# EasyEDA Pro project U2HTS_F070F6.epro

# Schematic Sch
Board Name: U2HTS_F070F6; Create Date: 2025-08-04; Page Name: P1; Project Name: USB电容触摸屏驱动板; Schematic Name: Sch; Update Date: 2025-08-04; Company: 嘉立创EDA; Page Size: A4; Version: V1.0
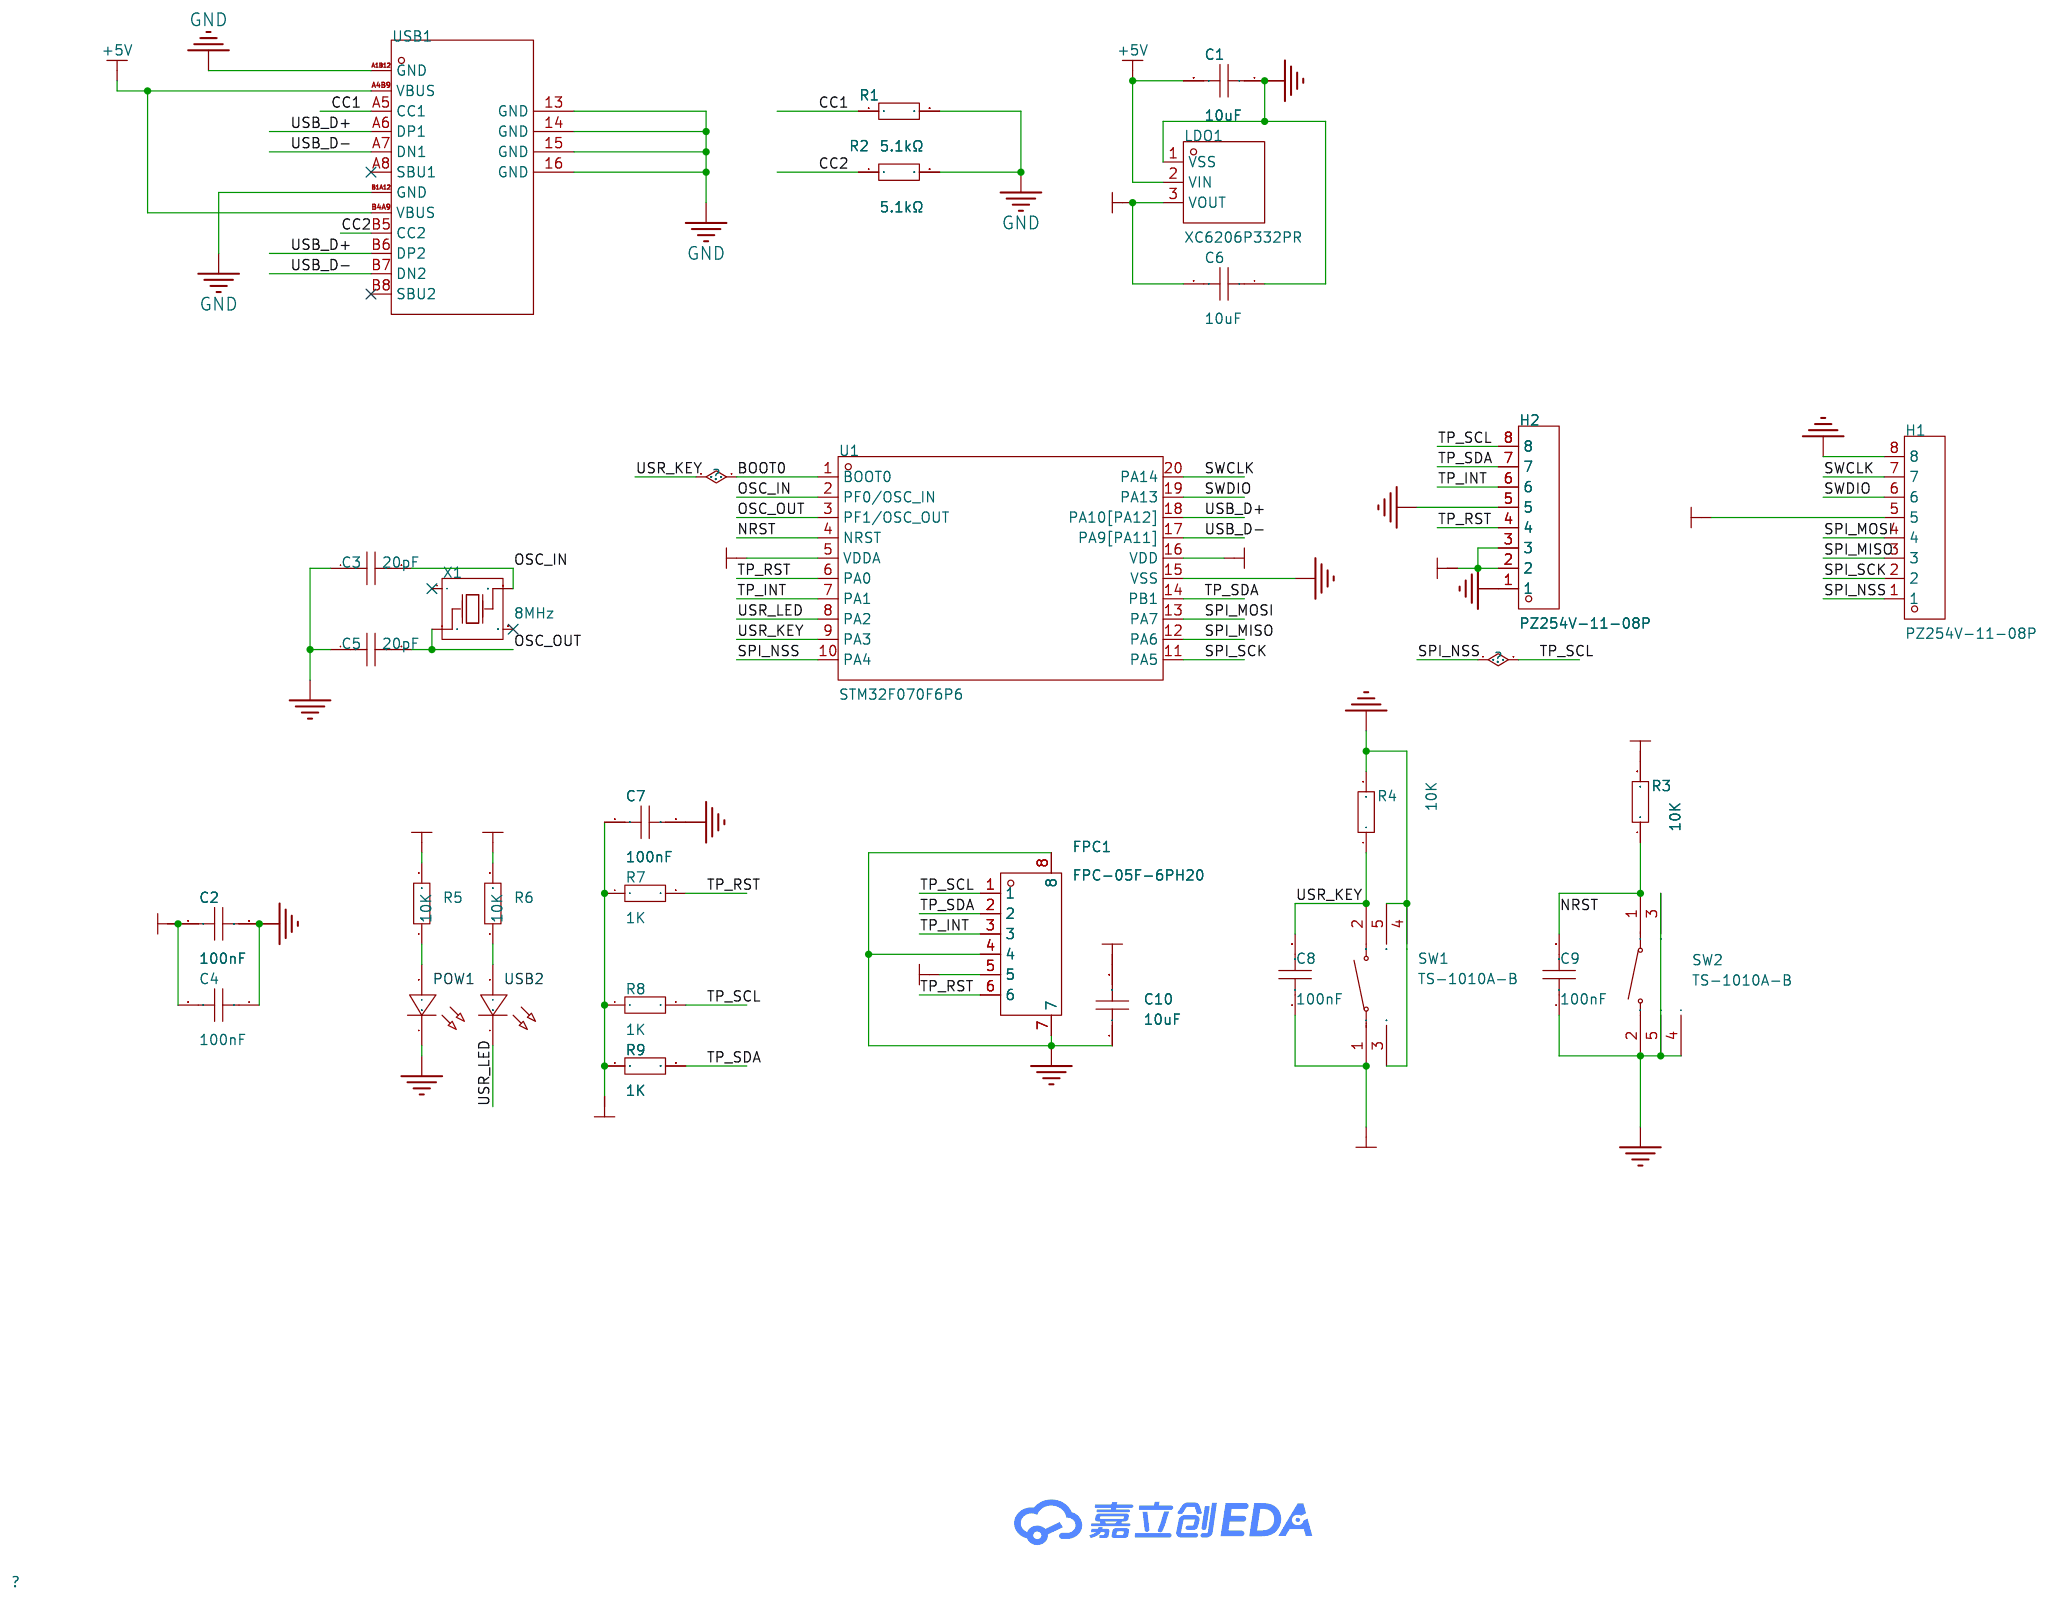
[diagram p0: schematic sheet]

## Parts
C1  10uF  [C0603]
C2  100nF  [C0402]
C3  20pF  [C0402]
C4  100nF  [C0402]
C5  20pF  [C0402]
C6  10uF  [C0603]
C7  100nF  [C0402]
C8  100nF  [C0402]
C9  100nF  [C0402]
C10  10uF  [C0603]
FPC1  FPC-05F-6PH20  [FPC-SMD_6P-P0.50_XUNPU_FPC-05F-6PH20]
H1  PZ254V-11-08P  [HDR-TH_8P-P2.54-V-M]
H2  PZ254V-11-08P  [HDR-TH_8P-P2.54-V-M]
LDO1  XC6206P332PR  [SOT-89-3_L4.5-W2.5-P1.50-LS4.2-BR]
POW1  -  [LED_0603]
R1  5.1kΩ  [R0402]
R2  5.1kΩ  [R0402]
R3  10K  [R0402]
R4  10K  [R0402]
R5  10K  [R0402]
R6  10K  [R0402]
R7  1K  [R0402]
R8  1K  [R0402]
R9  1K  [R0402]
SW1  TS-1010A-B  [SW-SMD_TS-1010A-B]
SW2  TS-1010A-B  [SW-SMD_TS-1010A-B]
U1  STM32F070F6P6  [TSSOP-20_L6.5-W4.4-P0.65-LS6.4-BL]
USB1  -  [USB-C-SMD_TYPEC-304-BCP16]
USB2  -  [LED_0603]
X1  8MHz  [CRYSTAL-SMD_4P-L3.2-W2.5-BL]

## Library data of the parts
C1 C6 = HGC0603R5106M160NTHJ: 容值:10uF;精度:±20%;额定电压:16V;材质(温度系数):X5R;; LCSC Part Name: 10uF ±20% 16V; Supplier Part: C7472959; Manufacturer: Chinocera(华瓷); Supplier Footprint: 0603; JLCPCB Part Class: Extended Part; Datasheet: https://atta.szlcsc.com/upload/public/pdf/source/20240320/FAC3FEC40A78BC5CCCE96C232A94D860.pdf; Supplier: LCSC; Tolerance: ±20%; Voltage Rated: 16V; Temperature Coefficient: X5R
C2 C4 C7 = CAP_0402: Supplier Footprint: 0402
C3 C5 C8 C9 = CAP_0603: Supplier Footprint: 0603
C10 = CGA0603X5R106K100JT: 容值:10uF;精度:±10%;额定电压:10V;材质(温度系数):X5R;; LCSC Part Name: 10uF ±10% 10V; Supplier Part: C6119842; Manufacturer: HRE(芯声); Supplier Footprint: 0603; JLCPCB Part Class: Extended Part; Supplier: LCSC; Tolerance: ±10%; Voltage Rated: 10V; Temperature Coefficient: X5R
FPC1 = FPC-05F-6PH20: 锁定特性:翻盖式;触点类型:下接;触点数量:6P;间距:0.5mm;安装类型:卧贴;工作温度范围:-25℃~+85℃;; LCSC Part Name: 间距:0.5mm P数:6P 翻盖式 下接; Supplier Part: C2856796; Manufacturer: XUNPU(讯普); Supplier Footprint: SMD,P=0.5mm,卧贴; JLCPCB Part Class: 扩展库; Datasheet: https://atta.szlcsc.com/upload/public/pdf/source/20210922/16B003FB53336DDF6538142CC465AC4D.pdf; Supplier: LCSC; Locking Feature: 翻盖式; Contact Type: 下接; Number of Contacts: 6P; Pitch: 0.5mm; Mounting Type: 卧贴; FFC, FCB Thickness: 0.3mm; Height Above Board: 2mm; Operating Temperature Range: -25℃~+85℃
H1 H2 = PZ254V-11-08P: 插针结构:1x8P;间距:2.54mm;行距:-;圆针/方针:方针;安装类型:直插;排数:单排;总PIN位数:8P;额定电流:-;额定电压:-;配合针长度:6mm;塑高:2.5mm;端接针长度:3mm;触头材质:黄铜;触头镀层:-;工作温度范围:-40℃~+105℃;颜色:黑色;; LCSC Part Name: 间距:2.54mm 1x8P 直插 方针; Supplier Part: C492407; Manufacturer: XFCN(兴飞); Supplier Footprint: 插件,P=2.54mm; JLCPCB Part Class: 扩展库; Datasheet: https://atta.szlcsc.com/upload/public/pdf/source/20200309/C492407_83A6FB26A2233368EDB9516968EC6149.pdf; Supplier: LCSC; Pin Structure: 1x8P; Pitch: 2.54mm; Circluar Pins/Square Pins: 方针; Mounting Type: 直插; Number of Rows: 单排; Number of Pins: 8P; Length of Mating Pin: 6mm; Insulation Height: 2.5mm; Length of End Connection Pin: 3mm; Contact Material: 黄铜; Operating Temperature Range: -40℃~+105℃; Color: 黑色
LDO1 = XC6206P332PR_C545581: 输出类型:固定;最大输入电压:8V;输出电压:3.3V;输出电流:250mA;电源纹波抑制比(PSRR):40dB@(1kHz);输出极性:正极;; Supplier Part: C545581; Manufacturer: UMW(友台半导体); Supplier Footprint: SOT-89-3; JLCPCB Part Class: 扩展库; Datasheet: https://atta.szlcsc.com/upload/public/pdf/source/20241029/DFB0998C0588718C146C8B83CE14F55A.pdf; Supplier: LCSC; Output Type: 固定; Maximum Input Voltage: 8V; Output Voltage: 3.3V; Output Current: 250mA; Power Supply Rejection Ratio (PSRR): 40dB@(1kHz); Dropout Voltage: 240mV@(50mA); Feature: 过流保护(OCP)；短路保护; Operating Temperature: -25℃~+80℃; Output Polarity: 正极; Number of Outputs: 1
POW1 = LED_0603-G: Supplier Footprint: 0603
R1 R2 = RMC04025.1K1%N: 阻值:5.1kΩ;精度:±1%;功率:62.5mW;; LCSC Part Name: 5.1kΩ ±1% 62.5mW; Supplier Part: C325521; Manufacturer: Tyohm(幸亚电阻); Supplier Footprint: 0402; JLCPCB Part Class: Extended Part; Datasheet: https://atta.szlcsc.com/upload/public/pdf/source/20190115/C325521_1EC5F156994D781C7E2B08432302F19F.pdf; Supplier: LCSC; Tolerance: ±1%; Power(Watts): 62.5mW
R3-R6 = Res_0603: Supplier Footprint: 0603
R7-R9 = Res_0402: Supplier Footprint: 0402
SW1 SW2 = TS-1010A-B: 电路结构:单刀单掷;按钮形状:矩形按钮;作用力:160gf;安装方式:卧贴;开关长度:4.5mm;开关宽度:3.5mm;开关高度:1.7mm;带支架:不带;触点电流:50mA;额定电压(DC):12V;绝缘电阻:-;带灯:无;机械寿命:10万次;; LCSC Part Name: 4.5*3.5*1.7mm 卧贴 轻触开关; Supplier Part: C381059; Manufacturer: XKB Connectivity(中国星坤); Supplier Footprint: SMD; JLCPCB Part Class: Extended Part; Datasheet: https://atta.szlcsc.com/upload/public/pdf/source/20211015/FACDEE6709A06A12AFA0124F93A467E8.pdf; Supplier: LCSC; Circuit: 单刀单掷; Actuator Style: 矩形按钮; Operating Force: 160gf; Mounting Style: 卧贴; Switch Length: 4.5mm; Switch Width: 3.5mm; Switch Height: 1.7mm; Strike Gundam: 不带; Contact Current: 50mA; Voltage Rating (DC): 12V; Actuator/Cap Color: 黑色; With Lamp: 无; Mechanical Life: 10万次; Operating Temperature: -30℃~+85℃
U1 = STM32F070F6P6: CPU内核:ARM-M0;CPU最大主频:48MHz;应用领域:-;; LCSC Part Name: 主流ARM Cortex-M0超值系列MCU，具有至多32 KB Flash、48 MHz CPU和USB功能; Supplier Part: C86951; Manufacturer: ST(意法半导体); Supplier Footprint: TSSOP-20; JLCPCB Part Class: 扩展库; Datasheet: https://atta.szlcsc.com/upload/public/pdf/source/20170105/1483608757662.pdf; Supplier: LCSC; CPU Core: ARM-M0; CPU Maximum Speed: 48MHz; Program Storage Size: 32KB; Program Memory Type: FLASH; Number of I/O: 15; ADC (Bit): 12bit; Low Voltage Detection Threshold: 2.4V~3.6V
USB1 = typec-304-bcp16: 连接器类型:Type-C;标准:USB 3.1;公母:母座;触点数量:16.0;端口数量:1;安装方式:卧贴;额定电流 - 电源:3A;工作温度范围:-25~+85;焊接温度(最大值):260;; LCSC Part Name: TYPEC-304-BCP16; Supplier Part: C720629; Manufacturer: XUNPU(讯普); Manufacturer Part: TYPEC-304-BCP16; Supplier Footprint: SMD; JLCPCB Part Class: Extended Part; Datasheet: https://atta.szlcsc.com/upload/public/pdf/source/20211022/DACD6552F639E9483017DE6DC0E61150.pdf; Supplier: LCSC; Connector Type: Type-C; Standard: USB 3.1; Gender: 母座; Number of Contacts: 16; Number of Ports: 1; Mounting Sytle: 卧贴; Current Rating - Power (Max): 3A; Operating Temperature Range: -25~+85; Welding Temperature (Max): 260
USB2 = LED_0603-B: Supplier Footprint: 0603
X1 = TAXM8M4RDBCCT2T: 晶振类型:贴片晶振;频率:8MHz;常温频差:±10ppm;负载电容:10pF;频率稳定度(全温):±15ppm;; LCSC Part Name: 8MHz ±10ppm 10pF; Supplier Part: C400090; Manufacturer: YJX(雅晶鑫); Supplier Footprint: SMD3225-4P; JLCPCB Part Class: 扩展库; Datasheet: https://atta.szlcsc.com/upload/public/pdf/source/20190626/C400090_CF95B89E745AFE4EF2E392EF8AC009D6.pdf; Supplier: LCSC; Crystal Type: 贴片晶振; Normal temperature Frequency Tolerance: ±10ppm; Load Capacitor: 10pF; Frequency Stability(Full temperature range): ±15ppm; Equivalent Series Resistance (ESR): 250Ω; Operating Temperature: -40℃~+85℃

## Nets
3V3: C2.1 C4.2 C6.2 C7.1 C8.1 C10.2 FPC1.5 H1.5 H2.2 H2.3 LDO1.3(VOUT) R3.2 R5.2 R6.2 R7.1 R8.1 R9.1 SW1.1 U1.5(VDDA) U1.16(VDD)
+5V: C1.2 LDO1.2(VIN) USB1.A4B9(VBUS) USB1.B4A9(VBUS)
GND: C1.1 C2.2 C3.1 C4.1 C5.1 C6.1 C7.2 C9.1 C10.1 FPC1.4 FPC1.7 FPC1.8 H1.8 H2.1 H2.5 LDO1.1(VSS) POW1.1(C) R1.2 R2.2 R4.2 SW1.3 SW1.4 SW1.5 SW2.2 SW2.3 SW2.4 SW2.5 U1.15(VSS) USB1.13(GND) USB1.14(GND) USB1.15(GND) USB1.16(GND) USB1.A1B12(GND) USB1.B1A12(GND)
BOOT0: C8.2 R4.1 SW1.2 U1.1(BOOT0) U1.9(PA3)
CC1: R1.1 USB1.A5(CC1)
CC2: R2.1 USB1.B5(CC2)
NRST: C9.2 R3.1 SW2.1 U1.4(NRST)
OSC_IN: C3.2 U1.2(PF0/OSC_IN) X1.3
OSC_OUT: C5.2 U1.3(PF1/OSC_OUT) X1.1
SPI_MISO: H1.3 U1.12(PA6)
SPI_MOSI: H1.4 U1.13(PA7)
SPI_NSS: FPC1.1 H1.1 H2.8 R8.2 U1.10(PA4)
SPI_SCK: H1.2 U1.11(PA5)
SWCLK: H1.7 U1.20(PA14)
SWDIO: H1.6 U1.19(PA13)
TP_INT: FPC1.3 H2.6 U1.7(PA1)
TP_RST: FPC1.6 H2.4 R7.2 U1.6(PA0)
TP_SDA: FPC1.2 H2.7 R9.2 U1.14(PB1)
USB_D+: U1.18(PA10[PA12]) USB1.A6(DP1) USB1.B6(DP2)
USB_D-: U1.17(PA9[PA11]) USB1.A7(DN1) USB1.B7(DN2)
USR_LED: U1.8(PA2) USB2.1(C)
$1N1839: POW1.2(A) R5.1
$1N1840: R6.1 USB2.2(A)

Not connected (* = marked no-connect by the designer): USB1 A8(SBU1)* B8(SBU2)*; X1 2* 4*

# Board PCB
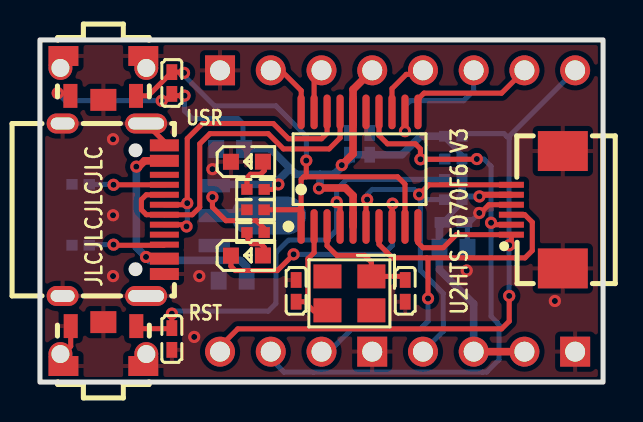
[diagram p1: board, top side]
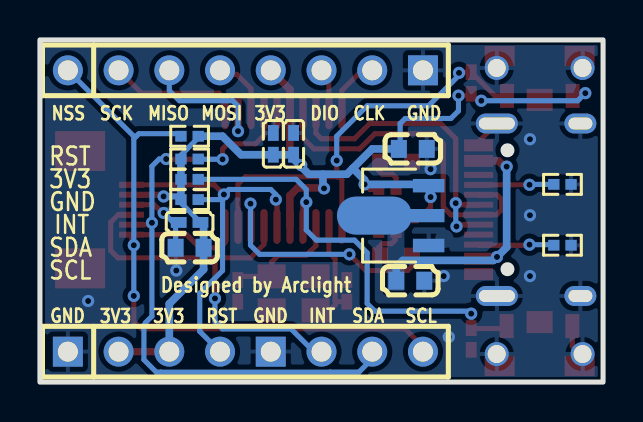
[diagram p2: board, bottom side, seen from below]

Outline 28.19 x 17.14 mm; copper layers: Top Layer, Bottom Layer. Coordinates in mm from the lower left corner of the outline.
Outline path: rectangle 0,17.14 28.19,0
Stack: Top Layer 0.035mm / Dielectric1 1.51mm FR4 er 4.5 / Bottom Layer 0.035mm

## Design rules (mm)
template: JLCPCB Capability(Two Layers Board)
spacing copperThickness1oz (default): track to track 0.102, other pairs 0.152 to 0.3
spacing copperThickness2oz: track to track 0.203, other pairs 0.152 to 0.3
track width copperThickness1oz (default): min 0.127, default 0.254, max 2.54
track width copperThickness2oz: min 0.203, default 0.254, max 2.54
differential pair differentialPair (default): width min 0.127, default 0.254, max 2.54; gap min 0.152, default 0.152
via viaSize (default): diameter min 0.5, default 0.61, max 10; hole min 0.3, default 0.305, max 6.3

## Placement (name value [footprint] x y rotation side)
C1  10uF  [C0603]  9.65 5.08 0 bottom
C2  100nF  [C0402]  16.51 11.94 90 bottom
C3  20pF  [C0402]  12.83 4.57 270 top
C4  100nF  [C0402]  15.49 11.94 270 bottom
C5  20pF  [C0402]  18.29 4.57 90 top
C6  10uF  [C0603]  9.53 11.68 0 bottom
C7  100nF  [C0402]  20.7 8 0 bottom
C8  100nF  [C0402]  6.6 14.99 90 top
C9  100nF  [C0402]  6.6 2.16 90 top
C10  10uF  [C0603]  20.7 6.73 180 bottom
FPC1  FPC-05F-6PH20  [FPC-SMD_6P-P0.50_XUNPU_FPC-05F-6PH20]  24.89 8.64 90 top
H1  PZ254V-11-08P  [HDR-TH_8P-P2.54-V-M#2]  17.91 15.62 180 bottom
H2  PZ254V-11-08P  [HDR-TH_8P-P2.54-V-M]  17.91 1.52 180 bottom
LDO1  XC6206P332PR  [SOT-89-3_L4.5-W2.5-P1.50-LS4.2-BR]  10.09 8.34 180 bottom
POW1  -  [LED_0603]  10.41 11.05 0 top
R1  5.1kΩ  [R0402]  2.03 9.91 180 bottom
R2  5.1kΩ  [R0402]  2.03 6.86 180 bottom
R3  10K  [R0402]  20.7 10.16 0 bottom
R4  10K  [R0402]  10.8 8.64 180 top
R5  10K  [R0402]  10.8 9.65 0 top
R6  10K  [R0402]  10.8 7.49 0 top
R7  1K  [R0402]  20.7 9.14 180 bottom
R8  1K  [R0402]  20.7 12.32 0 bottom
R9  1K  [R0402]  20.7 11.18 180 bottom
SW1  TS-1010A-B  [SW-SMD_TS-1010A-B]  3.18 15.24 90 top
SW2  TS-1010A-B  [SW-SMD_TS-1010A-B]  3.18 1.91 270 top
U1  STM32F070F6P6  [TSSOP-20_L6.5-W4.4-P0.65-LS6.4-BL]  16 10.67 0 top
USB1  -  [USB-C-SMD_TYPEC-304-BCP16]  3.68 8.64 270 top
USB2  -  [LED_0603]  10.41 6.35 0 top
X1  8MHz  [CRYSTAL-SMD_4P-L3.2-W2.5-BL]  15.49 4.44 180 top

## Footprints (pads in the part's own frame, mm; a bottom-side part is the same pattern mirrored in y, then rotated)
C0402
  rect 0.79x0.54 smd: 1(-0.545,0) 2(0.545,0)
C0603
  rect 0.8x0.9 smd: 1(-0.7,0) 2(0.7,0)
CRYSTAL-SMD_4P-L3.2-W2.5-BL
  rect 1.4x1.2 smd: 1(-1.1,-0.85) 2(1.1,-0.85) 3(1.1,0.85) 4(-1.1,0.85)
FPC-SMD_6P-P0.50_XUNPU_FPC-05F-6PH20
  rect 0.3x1.25 smd: 1(-1.25,1.288) 2(-0.75,1.288) 3(-0.25,1.288) 4(0.25,1.288) 5(0.75,1.288) 6(1.25,1.288)
  rect 2x2.5 smd: 7(2.94,-1.288) 8(-2.94,-1.288)
HDR-TH_8P-P2.54-V-M
  rect 1.5x1.5 hole 1: 1(-8.89,0) 5(1.27,0)
  round 1.5 hole 1: 2(-6.35,0) 3(-3.81,0) 4(-1.27,0) 6(3.81,0) 7(6.35,0) 8(8.89,0)
HDR-TH_8P-P2.54-V-M#2
  round 1.5 hole 1: 1(-8.89,0) 2(-6.35,0) 3(-3.81,0) 4(-1.27,0) 5(1.27,0) 6(3.81,0) 7(6.35,0)
  rect 1.5x1.5 hole 1: 8(8.89,0)
LED_0603
  rect 0.8x0.8 smd: 1(-0.851,-0.01) 2(0.75,-0.005)
R0402
  rect 0.566x0.54 smd: 1(-0.433,0) 2(0.433,0)
SOT-89-3_L4.5-W2.5-P1.50-LS4.2-BR
  rect 1.575x0.672 smd: 1(1.356,-1.5) 3(1.356,1.5)
  custom 5.377x1.9 smd: 2(-1.356,0)
SW-SMD_TS-1010A-B
  rect 1.2x0.7 smd: 1(-0.9,1.65) 2(-0.9,-1.635)
  rect 1.1x1.3 smd: 3(-1.1,0)
  round 1.2 hole 0.9: 4(0.5,2.15) 5(0.5,-2.15)
  rect 1x1.5 smd: 4(1.1,2) 5(1.1,-2)
TSSOP-20_L6.5-W4.4-P0.65-LS6.4-BL
  oval 0.364x1.742 smd: 1(-2.925,-2.871) 2(-2.275,-2.871) 3(-1.625,-2.871) 4(-0.975,-2.871) 5(-0.325,-2.871) 6(0.325,-2.871) 7(0.975,-2.871) 8(1.625,-2.871) 9(2.275,-2.871) 10(2.925,-2.871) 11(2.925,2.871) 12(2.275,2.871) 13(1.625,2.871) 14(0.975,2.871) 15(0.325,2.871) 16(-0.325,2.871) 17(-0.975,2.871) 18(-1.625,2.871) 19(-2.275,2.871) 20(-2.925,2.871)
USB-C-SMD_TYPEC-304-BCP16
  oval 1.001x2.1 hole 0.6x1.801: 13(-4.321,1.633) 14(4.321,1.633)
  oval 1.001x1.6 hole 0.6x1.199: 15(-4.321,-2.547) 16(4.321,-2.547)
  rect 0.6x1.45 smd: A1B12(-3.226,2.547) A4B9(-2.451,2.547) B1A12(3.22,2.547) B4A9(2.451,2.547)
  rect 0.299x1.45 smd: A5(-1.25,2.547) A6(-0.249,2.547) A7(0.249,2.547) A8(1.25,2.547) B5(1.75,2.547) B6(0.75,2.547) B7(-0.75,2.547) B8(-1.75,2.547)

## Nets
As in the schematic.

Pads without a net: USB1 A8 B8; X1 2 4

## Via types
v1: diameter 0.61, hole 0.305, Top Layer to Bottom Layer, 38 vias

## Routing (per net, layer and track width the routed paths; a pad name or vN(x,y) marks a point on that pad's centre or on a via; arc(x,y) is an arc through that point)
3V3: length 60.7
  Top Layer w0.254: R6.2 11.23,7.69 10.84,8.09 9.31,8.09 8.64,8.76 v1(8.64,9.27) ; v1(6.1,14.1) 6.26,14.1 C8.1 6.69,14.35 v1(7.24,14.35) ; R5.2 11.68,9.65 v1(11.94,9.91) ; SW1.1 1.39,14.48 v1(0.89,14.48)
  Top Layer w0.305: FPC1.5 22.09,9.39 v1(22,9.3)
  Top Layer w0.381: v1(13.97,9.7) 14,9.73 15.29,9.73 15.68,9.34 U1.5 ; H2.3 H2.2 ; v1(15.11,10.87) 15.68,11.44 15.68,14.66 H1.5
  Bottom Layer w0.254: v1(6.1,14.1) 1.27,14.1 v1(0.89,14.48) ; R8.1 20.27,12.24 21.13,11.37 R9.1 ; C6.2 10.16,11.75 10.16,12.95 9.91,13.21 7.62,13.21 7.24,13.59 v1(7.24,14.35) ; R7.1 21.13,8.98 C7.1 ; 8.64,9.53 8.64,9.65 8.76,9.78
  Bottom Layer w0.305: R7.1 21.29,9.3 v1(22,9.3)
  Bottom Layer w0.381: 12.53,10.71 11.56,11.68 C6.2 ; 12.53,10.71 12.83,10.41 14.02,10.41 ; 12.53,10.71 11.94,10.12 v1(11.94,9.91) 9.02,9.91 8.64,9.53 v1(8.64,9.27) ; H2.3 21.72,3.92 20,5.64 20,7.85 C7.1 ; v1(13.97,9.7) 14.02,9.76 14.02,10.41 ; 14.02,10.41 14.73,10.41 15.49,11.18 C4.2 C2.1 18.12,11.39 19.05,12.32 R8.1 ; R9.1 R3.2 R7.1
+5V: length 13.1
  Top Layer w0.254: v1(5.31,6.27) 5.4,6.19 USB1.B4A9
  Top Layer w0.381: v1(4.83,10.8) 4.95,10.8 5.24,11.09 6.23,11.09
  Bottom Layer w0.381: C1.2 10.35,5.78 10.03,6.1 5.49,6.1 v1(5.31,6.27) 4.83,6.76 v1(4.83,10.8)
GND: length 7.1
  Top Layer w0.254: USB1.A1B12 6.23,12.04 USB1.13 ; 1.54,2.68 1.54,1.79 1.03,1.28 ; FPC1.4 22.47,8.89 22.06,8.47 v1(22,8.47)
  Bottom Layer w0.254: C10.1 21.4,7.85 C7.2 21.52,8 v1(22,8.47)
  vias: v1(3.66,12.17) v1(3.66,8.36) v1(3.66,5.31) v1(7.72,2.26) v1(7.98,5.31) v1(8.64,10.67) v1(21.37,5.59) v1(25.78,4.06)
BOOT0: length 24.2
  Top Layer w0.254: 13.08,8.76 U1.1 ; 13.08,8.76 13.08,10.16 13.21,10.29 13.34,10.29 ; 13.08,8.76 12.95,8.64 R4.1 ; SW1.2 5.41,14.34 C8.2 7.18,15.53 v1(7.21,15.49) ; 13.34,10.29 17.91,10.29 18.28,9.92 U1.9 ; 13.34,10.29 v1(13.34,11.1)
  Bottom Layer w0.254: v1(7.21,15.49) 7.21,15.37 8.74,13.84 11.81,13.84 13.34,12.32 v1(13.34,11.1)
CC1: length 3.8
  Top Layer w0.254: USB1.A5 v1(3.68,9.89)
  Bottom Layer w0.254: R1.1 3.66,9.91 v1(3.68,9.89)
CC2: length 3.8
  Top Layer w0.254: v1(3.68,6.89) 3.71,6.86 6.2,6.86 USB1.B5
  Bottom Layer w0.254: R2.1 2.49,6.89 v1(3.68,6.89)
NRST: length 22.9
  Top Layer w0.254: 4.83,2.68 6.58,2.68 C9.2 v1(6.6,3.43) ; v1(14.86,9.02) 15.03,8.85 U1.4
  Bottom Layer w0.254: R3.1 15.37,10.16 14.86,9.65 v1(14.86,9.02) 14.86,7.62 14.35,7.11 12.45,7.11 11.81,6.48 11.81,3.94 11.43,3.56 6.73,3.56 v1(6.6,3.43)
OSC_IN: length 5.1
  Top Layer w0.254: U1.2 13.73,6.49 13.42,6.18 13.42,4.09 ; 13.42,4.09 13.35,4.03 C3.2 ; 13.42,4.09 13.42,3.86 13.72,3.56
OSC_OUT: length 6
  Top Layer w0.254: U1.3 14.38,6.83 14.86,6.35 16.26,6.35 16.59,6.01 16.59,5.3 18.11,5.3 C5.2
SPI_MISO: length 7
  Top Layer w0.254: 18.28,13.54 v1(18.28,12.57)
  Bottom Layer w0.254: v1(18.28,12.57) 18.28,13.83 18.54,14.1 21.21,14.1 21.72,14.61 H1.3
SPI_MOSI: length 3.1
  Top Layer w0.254: 17.63,13.54 17.63,14.71 18.34,15.42 18.98,15.42 H1.4
SPI_NSS: length 38.3
  Top Layer w0.254: v1(23.5,6.86) 23.6,6.97 FPC1.1 20.85,7.39 20.19,6.73 19.18,6.73 18.93,6.98 U1.10 ; v1(23.5,4.32) 23.5,3.05 23.11,2.67 9.91,2.67 9.02,1.78 9.02,1.52
  Bottom Layer w0.254: 21.13,12.19 21.13,12.37 21.21,12.45 23.24,12.45 23.37,12.32 ; 23.37,12.32 23.5,12.19 v1(23.5,6.86) v1(23.5,4.32) ; 23.37,12.32 23.5,12.32 H1.1
SPI_SCK: length 6.6
  Top Layer w0.254: 18.93,13.54 18.93,14.18 19.23,14.48 23.11,14.48 H1.2
SWCLK: length 3
  Top Layer w0.254: H1.7 12.06,15.62 13.08,14.61 13.08,13.54 13.08,13.54
SWDIO: length 2.2
  Top Layer w0.254: 13.73,13.54 13.73,15.25 H1.6
TP_INT: length 20.8
  Top Layer w0.254: 19.36,6.22 24.28,6.22 24.65,6.59 24.65,8.01 24.27,8.39 FPC1.3 ; 19.36,6.22 17.65,6.22 16.98,6.9 U1.7 ; 19.36,6.22 19.43,6.16 v1(19.43,4.19)
  Bottom Layer w0.254: v1(19.43,4.19) 19.43,3.05 19.05,2.67 15.62,2.67 14.48,1.52 H2.6
TP_RST: length 19.3
  Top Layer w0.254: FPC1.6 19.47,9.89 v1(18.98,9.4) ; U1.6 16.33,9.09 v1(16.38,9.14)
  Bottom Layer w0.254: v1(16.38,9.14) 16.38,9.4 16.64,9.65 18.73,9.65 v1(18.98,9.4) 19.05,9.33 ; 19.05,9.33 19.05,5.59 20.19,4.44 20.19,2.54 H2.4 ; 19.05,9.33 19.24,9.14 R7.2
TP_SDA: length 32.2
  Top Layer w0.254: v1(21.87,11.18) 21.86,11.16 v1(19.05,11.16) 19.05,11.68 18.8,11.94 17.4,11.94 16.98,12.36 16.98,13.54 ; FPC1.2 22.68,7.89 v1(22.59,7.98)
  Bottom Layer w0.254: R9.2 20.26,11.16 v1(19.05,11.16) ; v1(21.87,11.18) 22.22,11.18 22.59,10.81 v1(22.59,7.98) 22.59,3.3 22.91,2.97 22.91,2.93 22.99,2.86 22.99,1.12 22.37,0.5 22.15,0.5 22.14,0.5 13.67,0.5 13.67,0.5 12.22,0.5 11.56,1.16 H2.7
USB_D+: length 15.6
  Top Layer w0.254: v1(7.34,7.8) 7.25,7.89 USB1.B6 ; 14.38,13.54 14.38,12.47 14.1,12.19 12.45,12.19 11.68,12.95 8.13,12.95 7.38,12.2 v1(7.38,8.97) 7.29,8.89 USB1.A6
  Bottom Layer w0.254: v1(7.34,7.8) 7.38,7.83 v1(7.38,8.97)
USB_D-: length 17.2
  Top Layer w0.254: USB1.B7 5.32,9.39 5.08,9.14 5.08,8.64 5.33,8.39 USB1.A7 6.24,8.38 7.62,8.38 8,8.76 8,11.94 8.51,12.45 11.43,12.45 12.19,11.68 14.48,11.68 15.03,12.23 15.03,13.54
USR_LED: length 12.5
  Top Layer w0.254: U1.8 17.63,8.91 v1(17.65,8.94) ; v1(12.7,6.4) 11.89,5.59 9.78,5.59 9.56,5.8 USB2.1
  Bottom Layer w0.254: v1(12.7,6.4) 17.2,6.4 17.65,6.86 v1(17.65,8.94)
$1N1839: length 2.1
  Top Layer w0.254: POW1.2 11.23,10.98 11.23,10.59 11.05,10.41 10.54,10.41 10.36,10.23 R5.1
$1N1840: length 1.9
  Top Layer w0.254: USB2.2 11.23,6.41 11.23,6.75 11.05,6.93 10.59,6.93 10.41,7.11 10.41,7.57 10.36,7.62

## Copper pours and planes (outline as drawn; the poured copper is in the pictures)
+5V on Bottom Layer: 9.95,8.34 10.8,8.34 10.8,4.57 9.95,4.57
GND on Top Layer: -3.17,18.92 29.59,18.92 29.59,-2.03 -3.17,-2.03
GND on Bottom Layer: -5.84,21.59 32.89,21.59 32.89,-3.17 -5.84,-3.17

## Text on the board
Bottom Silkscreen Layer: GND | SCL | CLK | SDA | DIO | INT | 3V3 | RST | MOSI | MISO | SCK | NSS | Designed by Arclight
Top Silkscreen Layer: USR | RST | JLCJLCJLCJLC | U2HTS F070F6 V3
